# EAGLE schematic 60-hv-amp-signal-path (EAGLE 6.6.0)
AUTHOR: Sean Leavey; COMPANY: Institute for Gravitational Research; DATE: 2016-04-19; DESCRIPTION: Differential output +/-400V; FRMLATEXSYNTAX: 0; INFOSETTINGS: Used by 'plot.ulp' - do not edit manually! |FileTime=2016-07-15, 15:03:05|FileVersion=2||[LabelBox]|Company=Institute for Gravitational Research|Title=Quad Differential HV Amplifier|Description=Differential output +-350V|Revision=2016-03-22|Date=2016-03-22|Author=Sean Leavey|RevisionDate1=2016-05-30|RevisionAuthor1=Sean Leavey|RevisionDate2=2016-07-15|RevisionAuthor2=Sean Leavey|RevisionDate3=|RevisionAuthor3=|RevisionDate4=|RevisionAuthor4=|RevisionDate5=|RevisionAuthor5=||[FrontMatter]|DocTitle=Quad differential HV amplifier|SubTitle=Circuit board documentation|Authors=Sean Leavey|Keywords=|Abstract=This circuit provides four differential HV amplifier channels with +/-10V differential input and up to +/-400V differential output. Switchable whitening is provided to allow for additional filtering. This is switched via digital CMOS integrated circuits, and a connector compatible with the ERC Speedmeter project's CDS digital signalling system must be utilised. In addition, further connectors are provided for monitor signals and front panel indicator LEDs.\n\nThere are 8 x PA95 power amplifiers on this board which produce considerable heat. You must attach these amplifiers to a heat sink, and isolated copper has been left at the top of the board to do so. Two sockets are available for the attachment of 12V fans, but these are not strictly necessary depending on the chosen enclosure, heat sink and available air flow - use common sense.\n\nThis board contains numerous vias which must be populated prior to operation. Use the vias diagram in this documentation to find their locations, and make a visual inspection to make sure there are no unsoldered component legs where there are connected tracks. If in doubt, solder it!\n\nIt is highly recommended to build this board in a modular form, testing it as you go. There are test pins provided for most critical signal paths. It will be difficult to debug this circuit after it is complete.\n\nResistors should have 1% tolerance unless otherwise stated. This includes the HV feedback resistors.|LaTeXSyntax=1||[Safety]|VoltageHazard=1|HeatHazard=1|Convection=1|ForcedAir=1|WaterCooling=0|LightHazard=0|LaserPower=1000|LaserWavelength=1064|LaserClass=6|LightPower=1000|LightInvisible=0||[Notes]|Machinery=0|IntendedUsers=0|DisplayHints=1|; PLOTSETTINGS: Used by 'plot.ulp' - do not edit manually! |FileTime=2016-07-15, 15:03:05|FileVersion=2||[Board]|CreateBoard=0|PadDisplay=0|CreateDrillPlan=0|SiebMeyerFormat=0|IsiDrillFormat=0|CreateSolderStop=0|CreateCreamMask=0|CreateLegend=0|DisplayDimension=0|DisplayReference=1|CompensateSkew=1||[Documentation]|CreateDocumentation=1|CreateSheetDocs=1|DisplayNames=1|DisplayValues=1|DisplaySimulate=0|CreatePartList=0|CreateBoardDocs=1|CreatePlaceplan=1|DisplayJumper=0|CreateWiring=0|DisplayVias=1|CreateDrillMap=1|Create800uMap=0|CreatePreview=0|CreateValueList=1|CreateNetList=0|CreateLaTeX=1||[Variants]|HighlightUndefines=1|HighlightVariants=1|ShowVariantLists=1||[BoardSetup]|ProcessPolygons=0|PageSize=1|PageOrientation=0|MarginLeft=5|MarginTop=5|MarginRight=5|MarginBottom=5|DrillRackMM=0||[DocumentationSetup]|BlackWhite=0|FigureWidth=168|FigureHeight=237|ShrinkFigure=1|ExpandFigure=0|FigureRotate=1|TextWidth=72|ValueLibrary=1|PalatinoFont=1|LuximonoFont=1|IgnoreWidth=1||[MiscSetup]|OutlinePrecision=0.5|OutlineDiameter=2|; REVISION: v2.1; REVISIONAUTHOR1: Sean Leavey; REVISIONAUTHOR2: Sean Leavey; REVISIONDATE1: 2016-05-30; REVISIONDATE2: 2016-07-15; TITLE: Quad Differential; TITLE2: HV Amplifier; VARIANTSETTINGS: Used by 'variants.ulp' - do not edit manually! |FileTime=2013-05-23, 16:49:02|FileVersion=1||Title0=0-400V|Description0=|
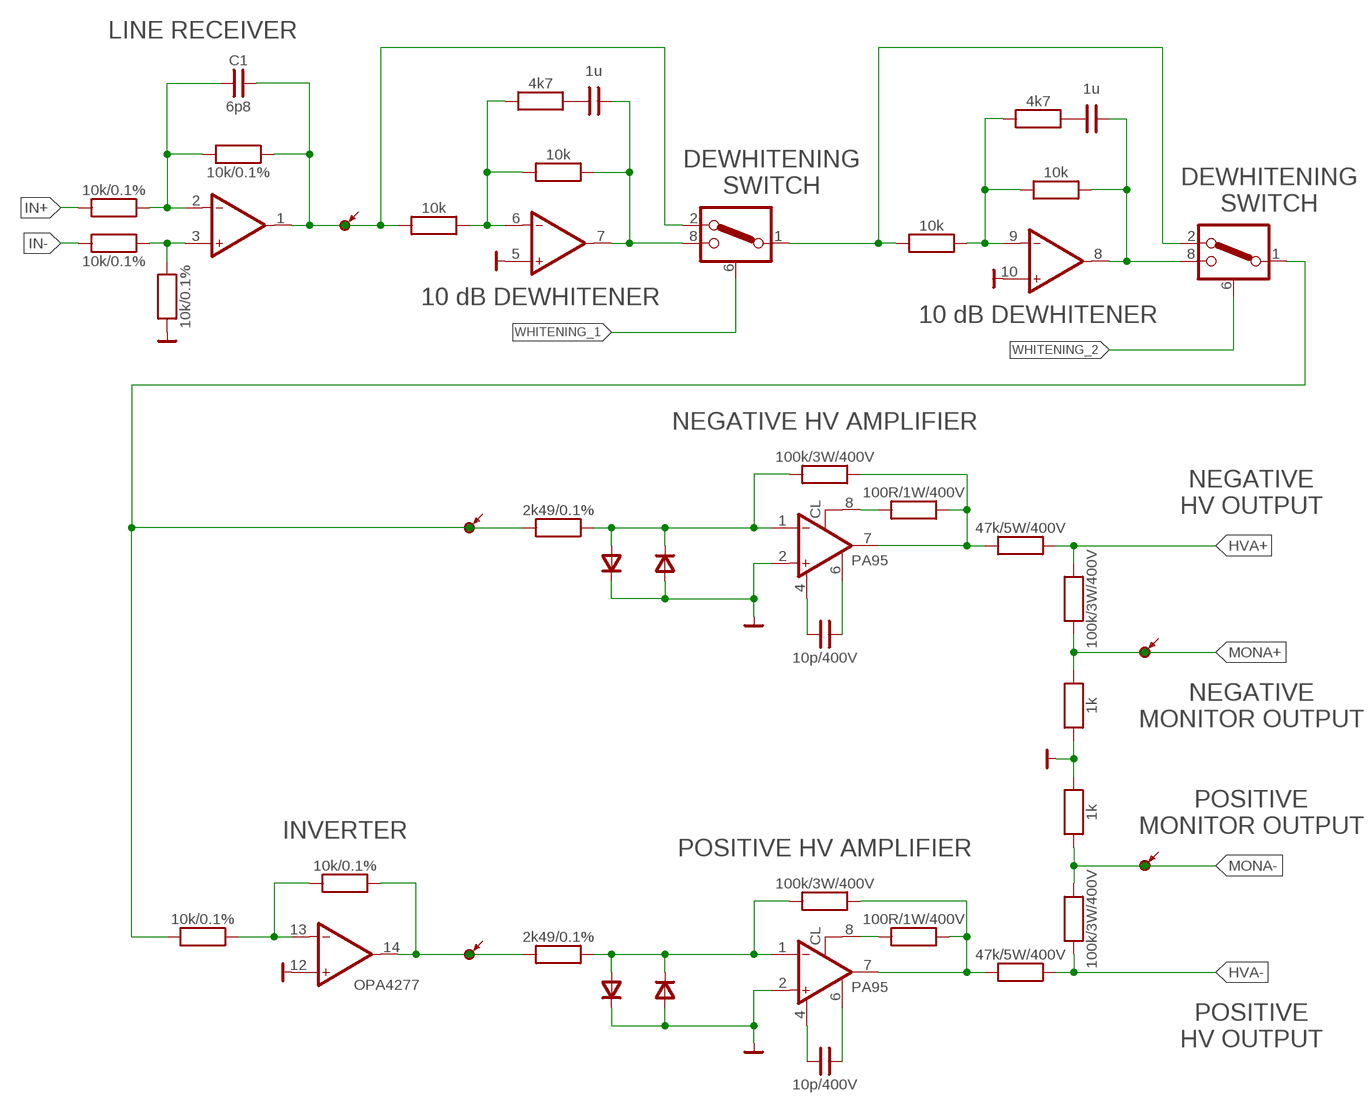
[diagram p0: schematic, sheet 1]

## Parts
C1  6p8  C03N  [C03N]
C5  1u  C02-MKS2-5.0-N  [C02-MKS2-5.0-N]
C9  1u  C02-MKS2-5.0-N  [C02-MKS2-5.0-N]
C13  10p/400V  C03N  [C03N]
C14  10p/400V  C03N  [C03N]
D1  1N4148  1N4148-04  [D04N-DO35-TYPE]
D2  1N4148  1N4148-04  [D04N-DO35-TYPE]
D9  1N4148  1N4148-04  [D04N-DO35-TYPE]
D10  1N4148  1N4148-04  [D04N-DO35-TYPE]
N1  OPA4277  OPA4277L  [DIP14L]
N5  MAX4659  DG419L  [DIP08L]
N9  MAX4659  DG419L  [DIP08L]
N13  PA95  [SIP03VR]
N14  PA95  [SIP03VR]
R1  10k/0.1%  RN  [R04N]
R2  10k/0.1%  RN  [R04N]
R9  10k/0.1%  RN  [R04N]
R13  10k/0.1%  RN  [R04N]
R17  10k  RN  [R04N]
R21  4k7  RN  [R04N]
R25  10k  RN  [R04N]
R29  10k  RN  [R04N]
R33  4k7  RN  [R04N]
R37  10k  RN  [R04N]
R41  10k/0.1%  RN  [R04N]
R45  10k/0.1%  RN  [R04N]
R49  2k49/0.1%  RN  [R04N]
R50  2k49/0.1%  RN  [R04N]
R57  100k/3W/400V  R05-1W  [R05-1W]
R58  100k/3W/400V  R05-1W  [R05-1W]
R65  100R/1W/400V  R04-1W  [R04-1W]
R66  100R/1W/400V  R04-1W  [R04-1W]
R73  47k/5W/400V  R04-1W  [R04-1W]
R74  47k/5W/400V  R04-1W  [R04-1W]
R81  100k/3W/400V  R05-1W  [R05-1W]
R82  1k  R04  [R04N]
R83  1k  R04  [R04N]
R84  100k/3W/400V  R05-1W  [R05-1W]
X1  IN  XT-0.8CERAM-N  [XT-0.8CERAM-N]
X5  HV_IN+  XT-0.8CERAM-N  [XT-0.8CERAM-N]
X6  HV_IN-  XT-0.8CERAM-N  [XT-0.8CERAM-N]
X13  MON+  XT-0.8CERAM-N  [XT-0.8CERAM-N]
X14  MON-  XT-0.8CERAM-N  [XT-0.8CERAM-N]

## Nets
GND: D1.C D2.C D9.A D10.A N1.5(B:IN+) N1.10(C:IN+) N1.12(D:IN+) N13.2(A:IN+) N14.2(A:IN+) R9.1 R82.1 R83.2 ; supply symbol labelled VG
HVA+ [HV]: R73.2 R81.2
HVA+_IN: N9.1(A:S1) R41.1 R49.1 X5.MP
HVA- [HV]: R74.2 R84.1
HVA-_IN: N1.14(D:OUT) R45.2 R50.1 X6.MP
IN+: R1.1
IN-: R2.1
MONA+: R81.1 R82.2 X13.MP
MONA-: R83.1 R84.2 X14.MP
N$1: C1.2 N1.1(A:OUT) N5.2(A:S2A) R13.2 R17.1 X1.MP
N$2: N1.6(B:IN-) R17.2 R21.1 R25.1
N$3: C5.2 N1.7(B:OUT) N5.8(A:S2B) R25.2
N$4: C5.1 R21.2
N$6: C9.1 R33.2
N$7 [HV]: C14.1 N14.4(A:CC1)
N$8: N1.9(C:IN-) R29.2 R33.1 R37.1
N$9: C9.2 N1.8(C:OUT) N9.8(A:S2B) R37.2
N$10: N1.3(A:IN+) R2.2 R9.2
N$11: D1.A D9.C N13.1(A:IN-) R49.2 R57.1
N$13: N5.1(A:S1) N9.2(A:S2A) R29.1
N$14: C1.1 N1.2(A:IN-) R1.2 R13.1
N$18 [HV]: C14.2 N14.6(A:CC2)
N$19 [HV]: C13.1 N13.4(A:CC1)
N$20 [HV]: C13.2 N13.6(A:CC2)
N$21 [HV]: N13.8(A:ILIM) R65.1
N$22: D2.A D10.C N14.1(A:IN-) R50.2 R58.1
N$23 [HV]: N14.8(A:ILIM) R66.1
N$40 [HV]: N13.7(A:OUT) R57.2 R65.2 R73.1
N$41 [HV]: N14.7(A:OUT) R58.2 R66.2 R74.1
N$52: N1.13(D:IN-) R41.2 R45.1
WHITENING_1: N5.6(A:D)
WHITENING_2: N9.6(A:D)

## Notes on the sheet
- LINE RECEIVER
- DEWHITENING
  SWITCH
- DEWHITENING
  SWITCH
- 10 dB DEWHITENER
- 10 dB DEWHITENER
- NEGATIVE HV AMPLIFIER
- NEGATIVE
  HV OUTPUT
- NEGATIVE
  MONITOR OUTPUT
- POSITIVE
  MONITOR OUTPUT
- INVERTER
- POSITIVE HV AMPLIFIER
- POSITIVE
  HV OUTPUT

## Power pins joined to a net without a drawn wire
GND: N5.3(P:GND) N9.3(P:GND)
V+: N1.4(P:V+) N5.4(P:V+) N9.4(P:V+) N13.12(P:V+) N14.12(P:V+)
V-: N1.11(P:V-) N5.7(P:V-) N9.7(P:V-) N13.10(P:V-) N14.10(P:V-)
VL: N5.5(P:VL) N9.5(P:VL)

## Library data of the parts
C1 C5 C9 C13 C14 = miscs:C: Capacitor, bipolar _____ Supported SPICE attributes: VALUE, VOLTAGE, CPARALLEL, LSERIES, RLSHUNT, RPARALLEL, RSERIES (A detailed description of these parameters can be found in the library spice.lbr) _____ References (PDF files, electronics workshop server): WIMA FKP 02 <http://elektronik.aei.uni-hannover.de:3000/datasheets/capacitors/wima-fkp02.pdf> (polypropylene film capacitors, 0.1" spacing) WIMA FKP 2 <http://elektronik.aei.uni-hannover.de:3000/datasheets/capacitors/wima-fkp2.pdf> (polypropylene film capacitors, 0.2" spacing) WIMA FKS 2 <http://elektronik.aei.uni-hannover.de:3000/datasheets/capacitors/wima-fks2.pdf> (polyester film capacitors, 0.2" spacing) WIMA MKP 2 <http://elektronik.aei.uni-hannover.de:3000/datasheets/capacitors/wima-mkp2.pdf> (polypropylene film capacitors, 0.2" spacing) WIMA MKS 02 <http://elektronik.aei.uni-hannover.de:3000/datasheets/capacitors/wima-mks02.pdf> (polyester film capacitors, 0.1" spacing) WIMA MKS 2 <http://elektronik.aei.uni-hannover.de:3000/datasheets/capacitors/wima-mks2.pdf> (polyester film capacitors, 0.2" spacing) Kemet ceramics <http://elektronik.aei.uni-hannover.de:3000/datasheets/capacitors/kemet-ceramics.pdf> (multilayer ceramic leaded capacitors) Vishay ceramics HV <http://elektronik.aei.uni-hannover.de:3000/datasheets/capacitors/vishay-ceramic-hv.pdf> (multilayer ceramic leaded capacitors, high voltage) LCR polystyrene <http://elektronik.aei.uni-hannover.de:3000/datasheets/capacitors/lcr-polystyrene.pdf> (polystyrene radial capacitors, 0.2" spacing); SPICE: <IDEALMODEL>\n<name:C> <pin:A.1> <pin:A.2> <autovalue><voltage: ic=>\n\n<REALMODEL>\n<name:C> <pin:A.1> <pin:A.2> <autovalue><voltage: ic=><rseries: rser=><lseries: lser=><rparallel: rpar=><cparallel: cpar=><rlshunt: rlshunt=>
D1 D2 D9 D10 = diodes:1N4148: 1N4148/LL4148/1N4448/LL4448: General purpose silicon diode 100V, 200mA, 500mW, 1V @ 10mA Wired packages: 1N4148/1N4448, MiniMELF package: LL4148/LL4448 _____ Supported SPICE subcircuits: 1N4148-SUB Supported SPICE attributes: TEMPERATURE; SPICE: <name:X> <pin:A.A> <pin:A.C> <subckt:1N4148-SUB><temperature: devicetemp=>; TYPE: 1N4148
N1 = opamps:OPA4277: OPA4277: Quad high precision opamp (Burr-Brown) ±15V, ±35mA, 4nA bias 50µV offset, 1MHz UGF, 8nV/rt(Hz) noise _____ References: - PDF datasheet <http://elektronik.aei.uni-hannover.de:3000/datasheets/opamps/opamps/opa4277.pdf> (electronics workshop server) - Manufacturer's link <http://www.ti.com/product/opa4277> (Texas Instruments website) - Internet search <http://www.google.de/search?q=opa4277 amplifier> (Google results) _____ Supported SPICE subcircuits: OPA277; SPICE: <gate:A>\n <name:X> <pin:A.IN+> <pin:A.IN-> <pin:P.V+> <pin:P.V-> <pin:A.OUT> <subckt:OPA277>\n\n<gate:B>\n <name:X> <pin:B.IN+> <pin:B.IN-> <pin:P.V+> <pin:P.V-> <pin:B.OUT> <subckt:OPA277>\n\n<gate:C>\n <name:X> <pin:C.IN+> <pin:C.IN-> <pin:P.V+> <pin:P.V-> <pin:C.OUT> <subckt:OPA277>\n\n<gate:D>\n <name:X> <pin:D.IN+> <pin:D.IN-> <pin:P.V+> <pin:P.V-> <pin:D.OUT> <subckt:OPA277>\n\n<gate:P>\n <ignore>
N5 N9 = ics:DG419: DG419: SPDT analog switch (Maxim) ±15V, 30Ω Ron, 175ns tswitch TTL level inputs, separate digital supply _____ References: - PDF datasheet <http://elektronik.aei.uni-hannover.de:3000/datasheets/ics/switches-multiplexers/dg419.pdf> (electronics workshop server) - Manufacturer's link <http://www.maximintegrated.com/datasheet/index.mvp/id/1005> (Maxim website) - Internet search <http://www.google.de/search?q=dg419> (Google results); VALUE: DG419
N13 N14 = mycomponents:PA95: PA95: High voltage power opamp (Apex) ±450V, ±100mA, 200pA bias 0.5mV offset, 10MHz UGF, 4nV/rt(Hz) noise _____ References: - Internet search <http://www.google.de/search?q=pa95> (Google results)
R1 R2 R9 R13 R17 R21 R25 R29 R33 R37 R41 R45 R49 R50 R57 R58 R65 R66 R73 R74 R81-R84 = miscs:R: Resistor, European symbol _____ Supported SPICE attributes: VALUE (A detailed description of these parameters can be found in the library spice.lbr); SPICE: <name:R> <pin:A.1> <pin:A.2> <autovalue>
X1 X5 X6 X13 X14 = connectors:XT: Test point _____ The colour of insulated ceramic test pins can be changed with the attribute COLOR.; IGNOREVALUE: 1; SPICE: <ignore>

## Net classes
0 default: width 0.813 mm, drill 0.813 mm, clearance 0.406 mm
1 HV: width 1.626 mm, drill 0.813 mm, clearance 0.813 mm